# EAGLE design sensors (EAGLE 9.1.1)
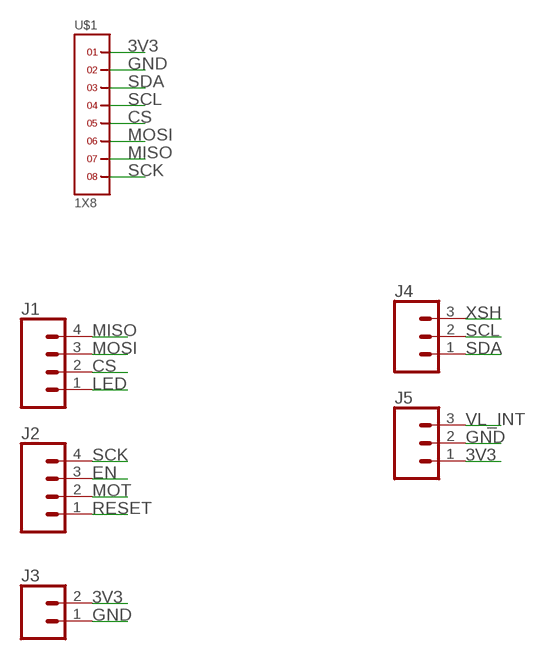
[diagram p0: schematic, sheet 1]

## Parts
J1  CONN_041X04_NO_SILK  [1X04_NO_SILK]
J2  CONN_041X04_NO_SILK  [1X04_NO_SILK]
J3  CONN_021X02_NO_SILK  [1X02_NO_SILK]
J4  CONN_031X03_NO_SILK  [1X03_NO_SILK]
J5  CONN_031X03_NO_SILK  [1X03_NO_SILK]
U$1  1X8  [1X8]

## Nets
3V3: J3.2 J5.1 U$1.1
CS: J1.2 U$1.5
EN: J2.3
GND: J3.1 J5.2 U$1.2
LED: J1.1
MISO: J1.4 U$1.7
MOSI: J1.3 U$1.6
MOT: J2.2
RESET: J2.1
SCK: J2.4 U$1.8
SCL: J4.2 U$1.4
SDA: J4.1 U$1.3
VL_INT: J5.3
XSH: J4.3

## Library data of the parts
J1 J2 = SparkFun-Connectors:CONN_04: Multi connection point. Often used as Generic Header-pin footprint for 0.1 inch spaced/style header connections On any of the 0.1 inch spaced packages, you can populate with these: Break Away Headers - Straight <https://www.sparkfun.com/products/116> (PRT-00116) Break Away Male Headers - Right Angle <https://www.sparkfun.com/products/553> (PRT-00553) Female Headers <https://www.sparkfun.com/products/115> (PRT-00115) Break Away Headers - Machine Pin <https://www.sparkfun.com/products/117> (PRT-00117) Break Away Female Headers - Swiss Machine Pin <https://www.sparkfun.com/products/743> (PRT-00743) For SCREWTERMINALS and SPRING TERMINALS visit here: Screw Terimnals on SparkFun.com <https://www.sparkfun.com/search/results?term=Screw+Terminals> (5mm/3.5mm/2.54mm spacing) This device is also useful as a general connection point to wire up your design to another part of your project. Our various solder wires solder well into these plated through hole pads. Hook-Up Wire - Assortment (Stranded, 22 AWG) <https://www.sparkfun.com/products/11375> (PRT-11375) Hook-Up Wire - Assortment (Solid Core, 22 AWG) <https://www.sparkfun.com/products/11367> (PRT-11367) View the entire wire category on our website here <https://www.sparkfun.com/categories/141> Special notes: Molex polarized connector foot print use with SKU : PRT-08231 with associated crimp pins and housings. 1MM SMD Version SKU: PRT-10208; PROD_ID: CONN-09696
J3 = SparkFun-Connectors:CONN_02: Multi connection point. Often used as Generic Header-pin footprint for 0.1 inch spaced/style header connections On any of the 0.1 inch spaced packages, you can populate with these: Break Away Headers - Straight <https://www.sparkfun.com/products/116> (PRT-00116) Break Away Male Headers - Right Angle <https://www.sparkfun.com/products/553> (PRT-00553) Female Headers <https://www.sparkfun.com/products/115> (PRT-00115) Break Away Headers - Machine Pin <https://www.sparkfun.com/products/117> (PRT-00117) Break Away Female Headers - Swiss Machine Pin <https://www.sparkfun.com/products/743> (PRT-00743) For SCREWTERMINALS and SPRING TERMINALS visit here: Screw Terimnals on SparkFun.com <https://www.sparkfun.com/search/results?term=Screw+Terminals> (5mm/3.5mm/2.54mm spacing) This device is also useful as a general connection point to wire up your design to another part of your project. Our various solder wires solder well into these plated through hole pads. Hook-Up Wire - Assortment (Stranded, 22 AWG) <https://www.sparkfun.com/products/11375> (PRT-11375) Hook-Up Wire - Assortment (Solid Core, 22 AWG) <https://www.sparkfun.com/products/11367> (PRT-11367) View the entire wire category on our website here <https://www.sparkfun.com/categories/141> Special notes: Molex polarized connector foot print use with: PRT-08233 with associated crimp pins and housings. 2.54_SCREWTERM for use with PRT-10571. 3.5mm Screw Terminal footprints for PRT-08084 5mm Screw Terminal footprints for use with PRT-08432
J4 J5 = SparkFun-Connectors:CONN_03: Multi connection point. Often used as Generic Header-pin footprint for 0.1 inch spaced/style header connections On any of the 0.1 inch spaced packages, you can populate with these: Break Away Headers - Straight <https://www.sparkfun.com/products/116> (PRT-00116) Break Away Male Headers - Right Angle <https://www.sparkfun.com/products/553> (PRT-00553) Female Headers <https://www.sparkfun.com/products/115> (PRT-00115) Break Away Headers - Machine Pin <https://www.sparkfun.com/products/117> (PRT-00117) Break Away Female Headers - Swiss Machine Pin <https://www.sparkfun.com/products/743> (PRT-00743) Stackable Header - 3 Pin (Female, 0.1") <https://www.sparkfun.com/products/13875> (PRT-13875) For SCREWTERMINALS and SPRING TERMINALS visit here: Screw Terimnals on SparkFun.com <https://www.sparkfun.com/search/results?term=Screw+Terminals> (5mm/3.5mm/2.54mm spacing) This device is also useful as a general connection point to wire up your design to another part of your project. Our various solder wires solder well into these plated through hole pads. Hook-Up Wire - Assortment (Stranded, 22 AWG) <https://www.sparkfun.com/products/11375> (PRT-11375) Hook-Up Wire - Assortment (Solid Core, 22 AWG) <https://www.sparkfun.com/products/11367> (PRT-11367) View the entire wire category on our website here <https://www.sparkfun.com/categories/141> Special notes: Molex polarized connector foot print use with SKU : PRT-08232 with associated crimp pins and housings.
U$1 = headers(2mm):1X8

## Board
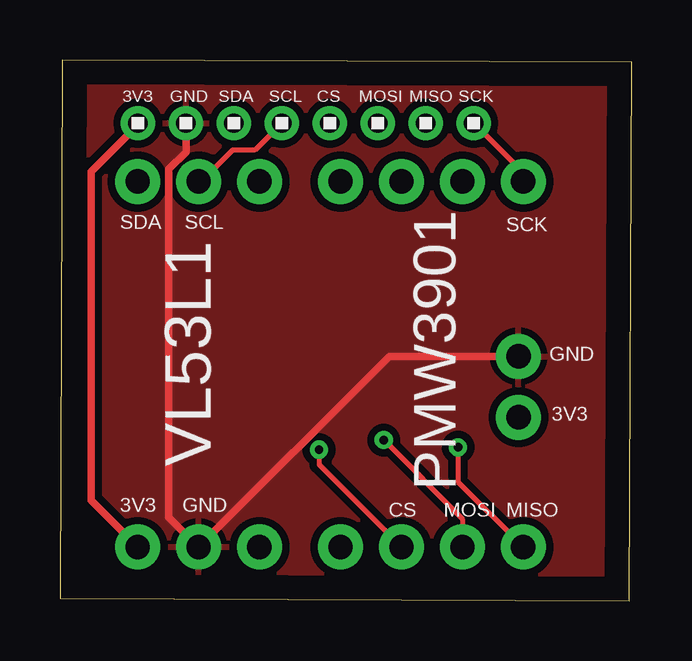
[diagram p1: board, top side]
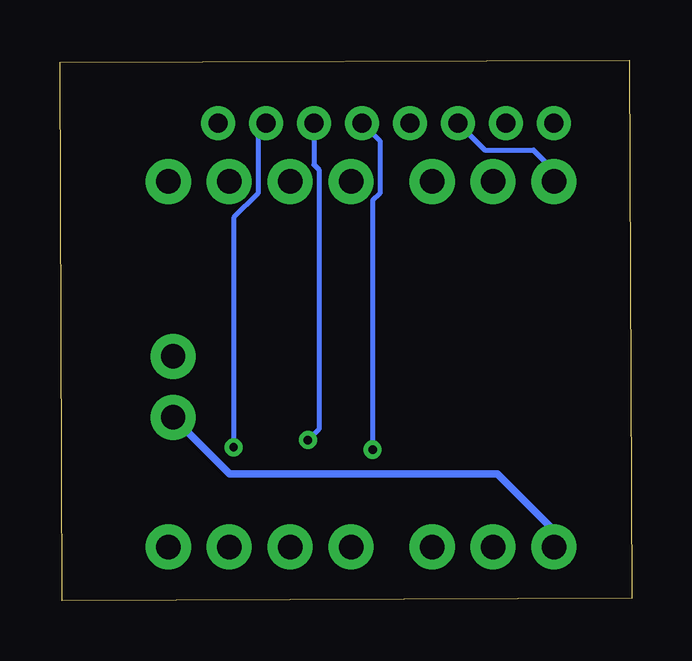
[diagram p2: board, bottom side, seen from below]

Size 23.84 x 22.55 mm. Coordinates in mm from the lower left corner, seen from the top.
Outline: 0,0.1 23.74,0 23.84,22.45 0.1,22.55 0,0.1
Copper layers (1*16): Top 0.035mm / dielectric 1.5mm / Bottom 0.035mm
Design rules "default": minimum track width 6mil, minimum drill 0.35mm, track to track 6mil, track to pad 6mil, pad to pad 6mil, via to via 6mil, smd to smd 6mil, copper to edge 40mil, drill to drill 6mil, minimum pad ring 10mil, minimum via ring 8mil, stop-mask expansion 4mil, vias tented up to drill 0mil, thermal gap 10mil

### Footprints (pad centres in the part's own frame; a part is rotated, then mirrored left to right if it is on the bottom)
1X04_NO_SILK = drill 1.016 pad 1.88: 1 0,0; 2 2.54,0; 3 5.08,0; 4 7.62,0
1X02_NO_SILK = drill 1.016 pad 1.88: 1 0,0; 2 2.54,0
1X03_NO_SILK = drill 1.016 pad 1.88: 1 0,0; 2 2.54,0; 3 5.08,0
1X8 = drill 0.8 pad 1.422: 1 -7,0; 2 -5,0; 3 -3,0; 4 -1,0; 5 1,0; 6 3,0; 7 5,0; 8 7,0

### Placement (x,y rotation side)
J1  11.7,2.24 0 top
J2  11.7,17.48 0 top
J3  19.12,10.19 270 top
J4  3.24,17.48 0 top
J5  3.24,2.24 0 top
U$1  10.25,19.92 0 top

### Tracks (layer width: path | path; a pad name or v marks a point on that pad's centre or on a via)
3V3
  Top 0.305: J5.1 1.3,4.18 1.3,17.9 3.25,19.85 U$1.1
  Bottom 0.305: J3.2 16.77,5.3 5.6,5.3 3.24,2.94 J5.1
CS  (via drill 0.35)
  Top 0.203: v10.8,6.3 10.8,5.68 J1.2
  Bottom 0.203: v10.8,6.3 10.8,16.69 10.51,16.99 10.51,19.18 U$1.5
GND
  Top 0.305: U$1.2 5.25,18.71 4.54,18 4.54,3.48 J5.2 13.73,10.19 J3.1
  pour Top (isolate 0.305): -0.1,22.6 23.8,22.6 23.8,-0.2 -0.1,-0.2
MISO  (via drill 0.35)
  Top 0.203: v16.6,6.4 16.6,4.96 J1.4
  Bottom 0.203: U$1.7 15.59,19.58 15.59,16.99 16.6,15.97 v16.6,6.4
MOSI  (via drill 0.35)
  Top 0.203: v13.5,6.7 16.78,3.42 J1.3
  Bottom 0.203: U$1.6 13.25,18.18 13.05,17.97 13.05,7.15 v13.5,6.7
SCK
  Top 0.203: U$1.8 19.32,17.85 J2.4
SCL
  Top 0.203: U$1.4 8.13,18.8 7.2,18.8 5.88,17.48 J4.2
SDA
  Bottom 0.203: U$1.3 6.13,18.8 4.1,18.8 3.24,17.94 J4.1

### Text on the board
tNames: 3V3 | GND | SDA | SCL | CS | MOSI | MISO | SCK | SDA | SCL | SCK | GND | 3V3 | VL53L1 | PMW3901 | 3V3 | GND | CS | MOSI | MISO